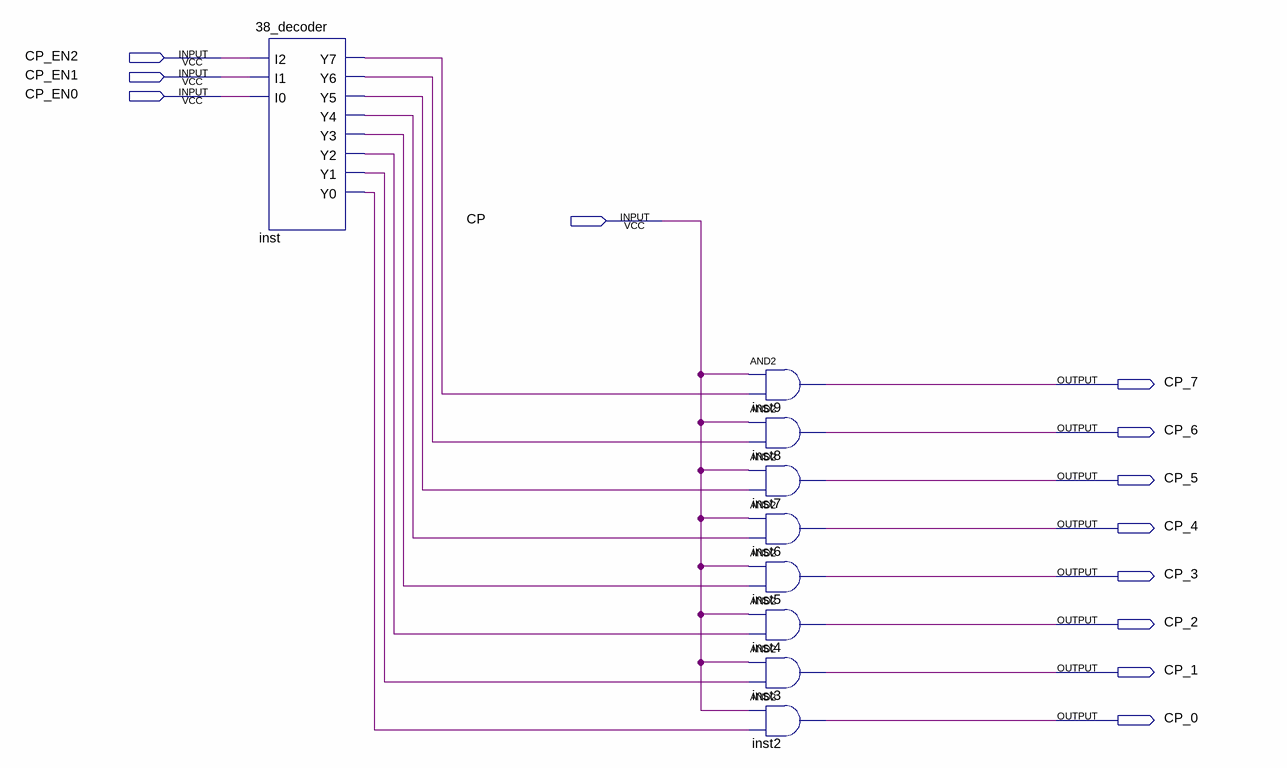
[diagram p0: schematic sheet]
// Quartus schematic cp_selector.bdf as structural Verilog: 9 symbols, 12 pins
module cp_selector (
  input  CP_EN2,
  input  CP_EN1,
  input  CP_EN0,
  input  CP,
  output CP_7,
  output CP_6,
  output CP_5,
  output CP_4,
  output CP_3,
  output CP_2,
  output CP_1,
  output CP_0
);

  wire inst_y0, inst_y1, inst_y2, inst_y3, inst_y4, inst_y5, inst_y6, inst_y7;

  \38_decoder  inst (
    .I2(CP_EN2), .I1(CP_EN1), .I0(CP_EN0), .Y7(inst_y7), .Y6(inst_y6), .Y5(inst_y5), .Y4(inst_y4),
    .Y3(inst_y3), .Y2(inst_y2), .Y1(inst_y1), .Y0(inst_y0));
  and inst9 (CP_7, CP, inst_y7);
  and inst8 (CP_6, CP, inst_y6);
  and inst7 (CP_5, CP, inst_y5);
  and inst6 (CP_4, CP, inst_y4);
  and inst5 (CP_3, CP, inst_y3);
  and inst4 (CP_2, CP, inst_y2);
  and inst3 (CP_1, CP, inst_y1);
  and inst2 (CP_0, CP, inst_y0);
endmodule
